# EasyEDA schematic SCH_videoplayer-system_2022-01-02-EASYEDA.json
TITLE: videoplayer; REV: 1.0; Date: 2021-11-22; Sheet: 1/1; Drawn By: Martin Cornu; Company: MartInc
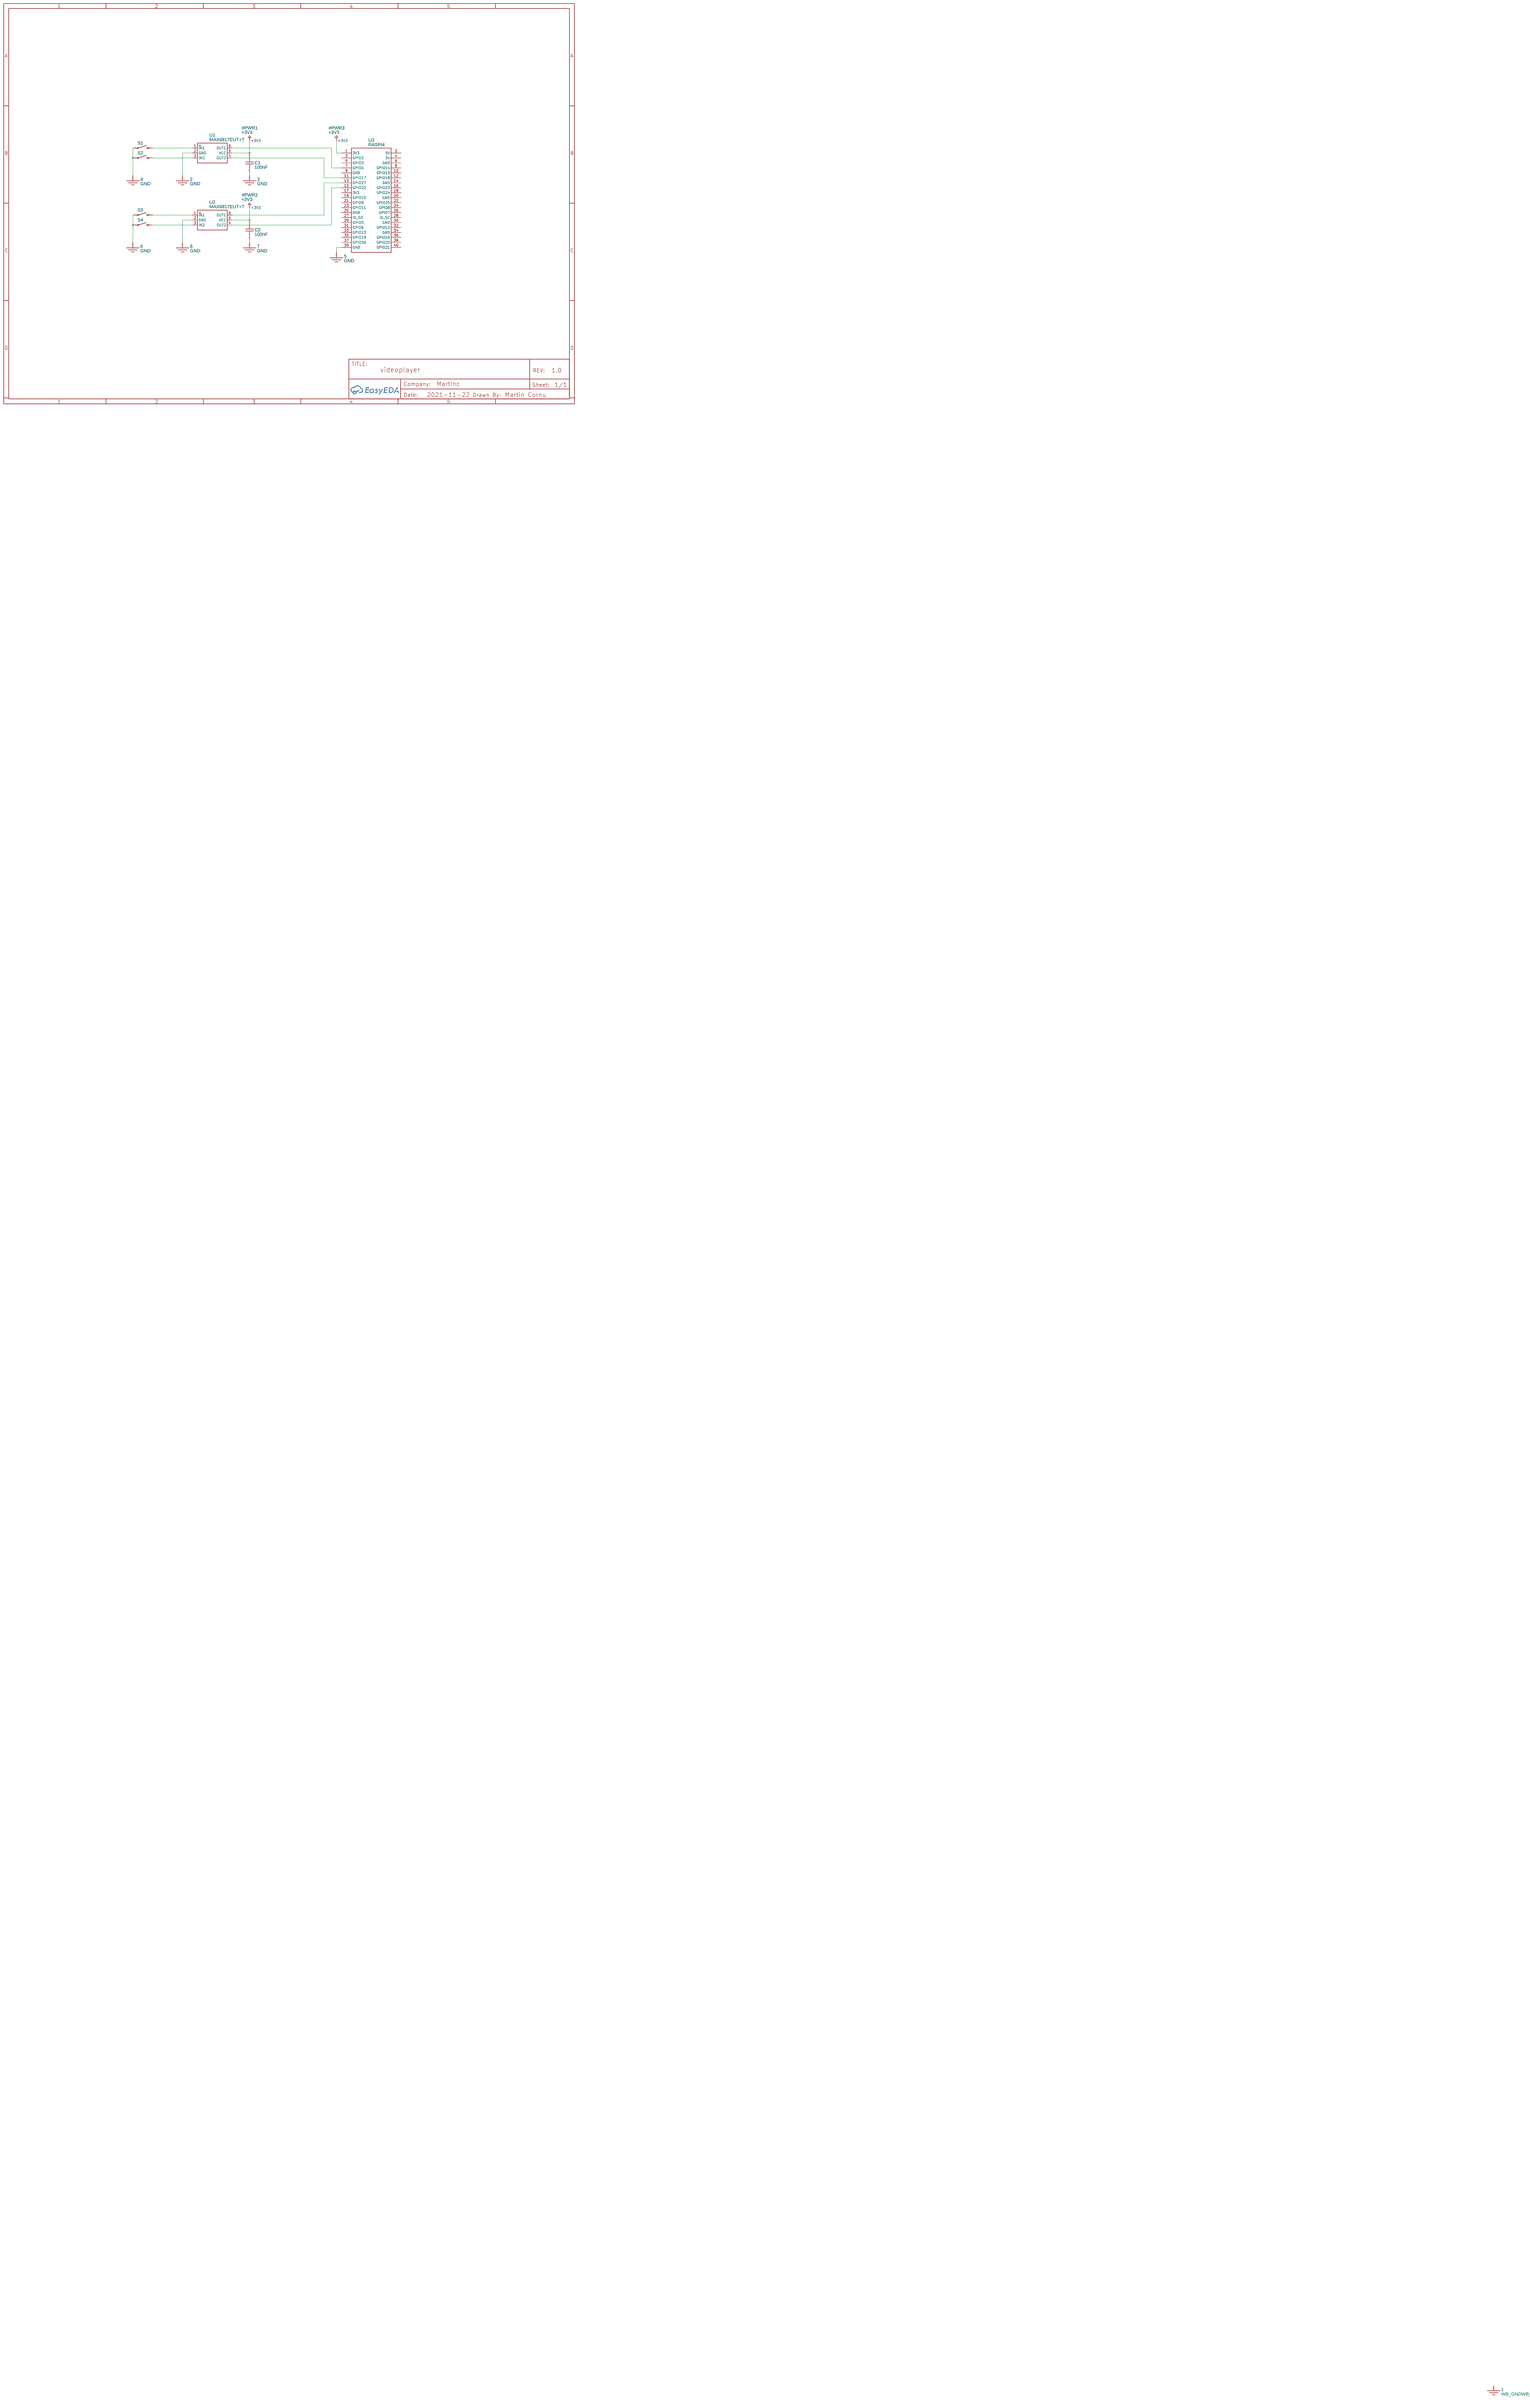
[diagram p0: schematic sheet]

## Parts
1  WB_GNDWB_GND  [WB_GND]
2  GND  [WB_GND]
3  GND  [WB_GND]
4  GND  [WB_GND]
5  GND  [WB_GND]
6  GND  [WB_GND]
7  GND  [WB_GND]
8  GND  [WB_GND]
#PWR1  +3V3
#PWR2  +3V3
#PWR3  +3V3
C1  100nF  [C0402]
C2  100nF  [C0402]
S1  SWITCH  [TACTILE-SWITCH-1101NE]
S2  SWITCH  [TACTILE-SWITCH-1101NE]
S3  SWITCH  [TACTILE-SWITCH-1101NE]
S4  SWITCH  [TACTILE-SWITCH-1101NE]
U1  MAX6817EUT+T  [SOT-23-6_L2.9-W1.6-P0.95-LS2.8-BR]
U2  MAX6817EUT+T  [SOT-23-6_L2.9-W1.6-P0.95-LS2.8-BR]
U3  RASPI4  [RASPBERRY PI 4]

## Library data of the parts
1-8 = WB_GNDWB_GND: Contributor: nick10mc
#PWR1-#PWR3 = +3V3: Contributor: KiCAD; license: https://www.gnu.org/licenses/lgpl-2.1.html
C1 C2 = GRM155R61C104KA88D: Supplier: LCSC; Manufacturer: MuRata; Supplier Part: C77005
S1-S4 = SWITCH-MOMENTARY-2-SMD-1101NE: Contributor: Pinoccio
U1 U2 = MAX6817EUT+T: Supplier: LCSC; Supplier Part: C516788; Manufacturer: Maxim Integrated; Contributor: LCSC; JLCPCB Part Class: Extended Part
U3 = RASPI4JANNES: Contributor: KUTLUHAN ARSLAN; subpart_no: 2

## Nets
Net-(2-1): 2.1 U1.2(GND)
Net-(3-1): 3.1 C1.1
Net-(4-1): 4.1 S1.P$1(1) S2.P$1(1)
Net-(5-1): 5.1 U3.39(GND)
Net-(6-1): 6.1 S3.P$1(1) S4.P$1(1)
Net-(7-1): 7.1 C2.1
Net-(8-1): 8.1 U2.2(GND)
Net-(#PWR1-1): #PWR1.1(+3V3) C1.2 U1.5(VCC)
Net-(#PWR2-1): #PWR2.1(+3V3) C2.2 U2.5(VCC)
Net-(#PWR3-1): #PWR3.1(+3V3) U3.1(3V3)
Net-(S1-P$2): S1.P$2(2) U1.1(IN1)
Net-(S2-P$2): S2.P$2(2) U1.3(IN2)
Net-(S3-P$2): S3.P$2(2) U2.1(IN1)
Net-(S4-P$2): S4.P$2(2) U2.3(IN2)
Net-(U1-4): U1.4(OUT2) U3.11(GPIO17)
Net-(U1-6): U1.6(OUT1) U3.7(GPIO4)
Net-(U2-4): U2.4(OUT2) U3.15(GPIO22)
Net-(U2-6): U2.6(OUT1) U3.13(GPIO27)

Not connected (* = marked no-connect by the designer): 1 1; U3 2(5V) 3(GPIO2) 4(5V) 5(GPIO3) 6(GND) 8(GPIO14) 9(GND) 10(GPIO15) 12(GPIO18) 14(GND) 16(GPIO23) 17(3V3) 18(GPIO24) 19(GPIO10) 20(GND) 21(GPIO9) 22(GPIO25) 23(GPIO11) 24(GPIO8) 25(GND) 26(GPIO7) 27(ID_SD) 28(ID_SC) 29(GPIO5) 30(GND) 31(GPIO6) 32(GPIO12) 33(GPIO13) 34(GND) 35(GPIO19) 36(GPIO16) 37(GPIO26) 38(GPIO20) 40(GPIO21)
